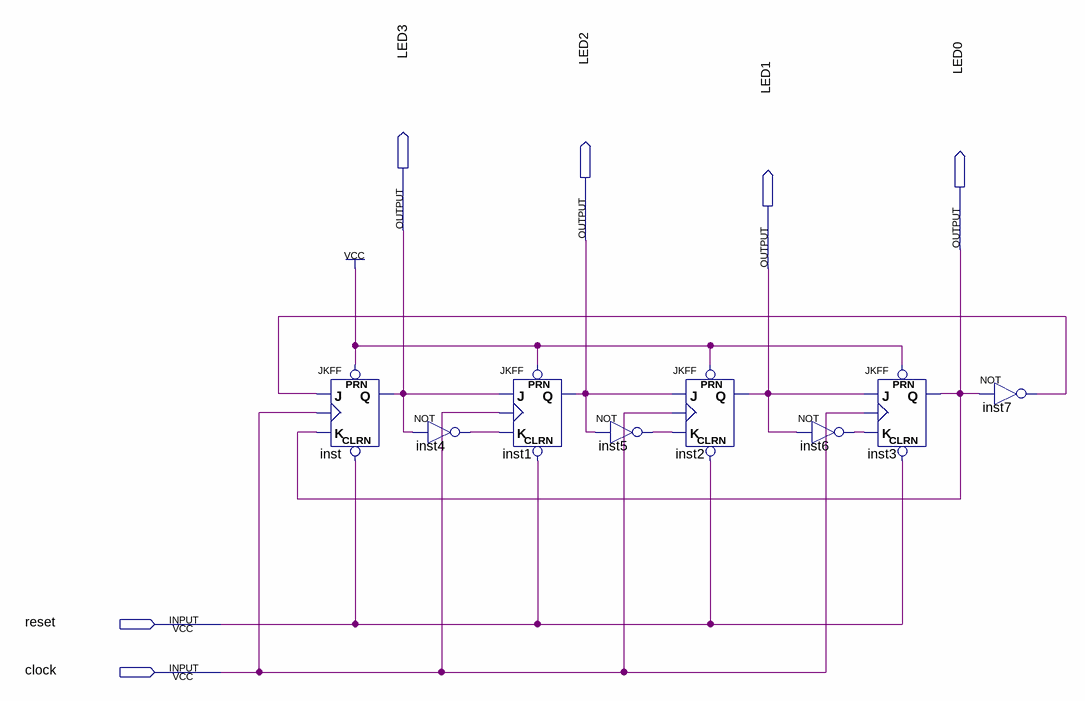
[diagram p0: schematic sheet]
// Quartus schematic JK_Shift_Counter.bdf as structural Verilog: 8 symbols, 6 pins
module JK_Shift_Counter (
  input  reset,
  input  clock,
  output LED3,
  output LED2,
  output LED0,
  output LED1
);

  wire inst4_out, inst5_out, inst6_out, inst7_out;

  JKFF inst (.PRN(1'b1), .CLRN(reset), .K(LED0), .J(inst7_out), .CLK(clock), .Q(LED3));
  not inst4 (inst4_out, LED3);
  JKFF inst1 (.PRN(1'b1), .CLRN(reset), .K(inst4_out), .J(LED3), .CLK(clock), .Q(LED2));
  not inst5 (inst5_out, LED2);
  JKFF inst2 (.PRN(1'b1), .CLRN(reset), .K(inst5_out), .J(LED2), .CLK(clock), .Q(LED1));
  not inst6 (inst6_out, LED1);
  JKFF inst3 (.PRN(1'b1), .CLRN(reset), .K(inst6_out), .J(LED1), .CLK(clock), .Q(LED0));
  not inst7 (inst7_out, LED0);
endmodule
